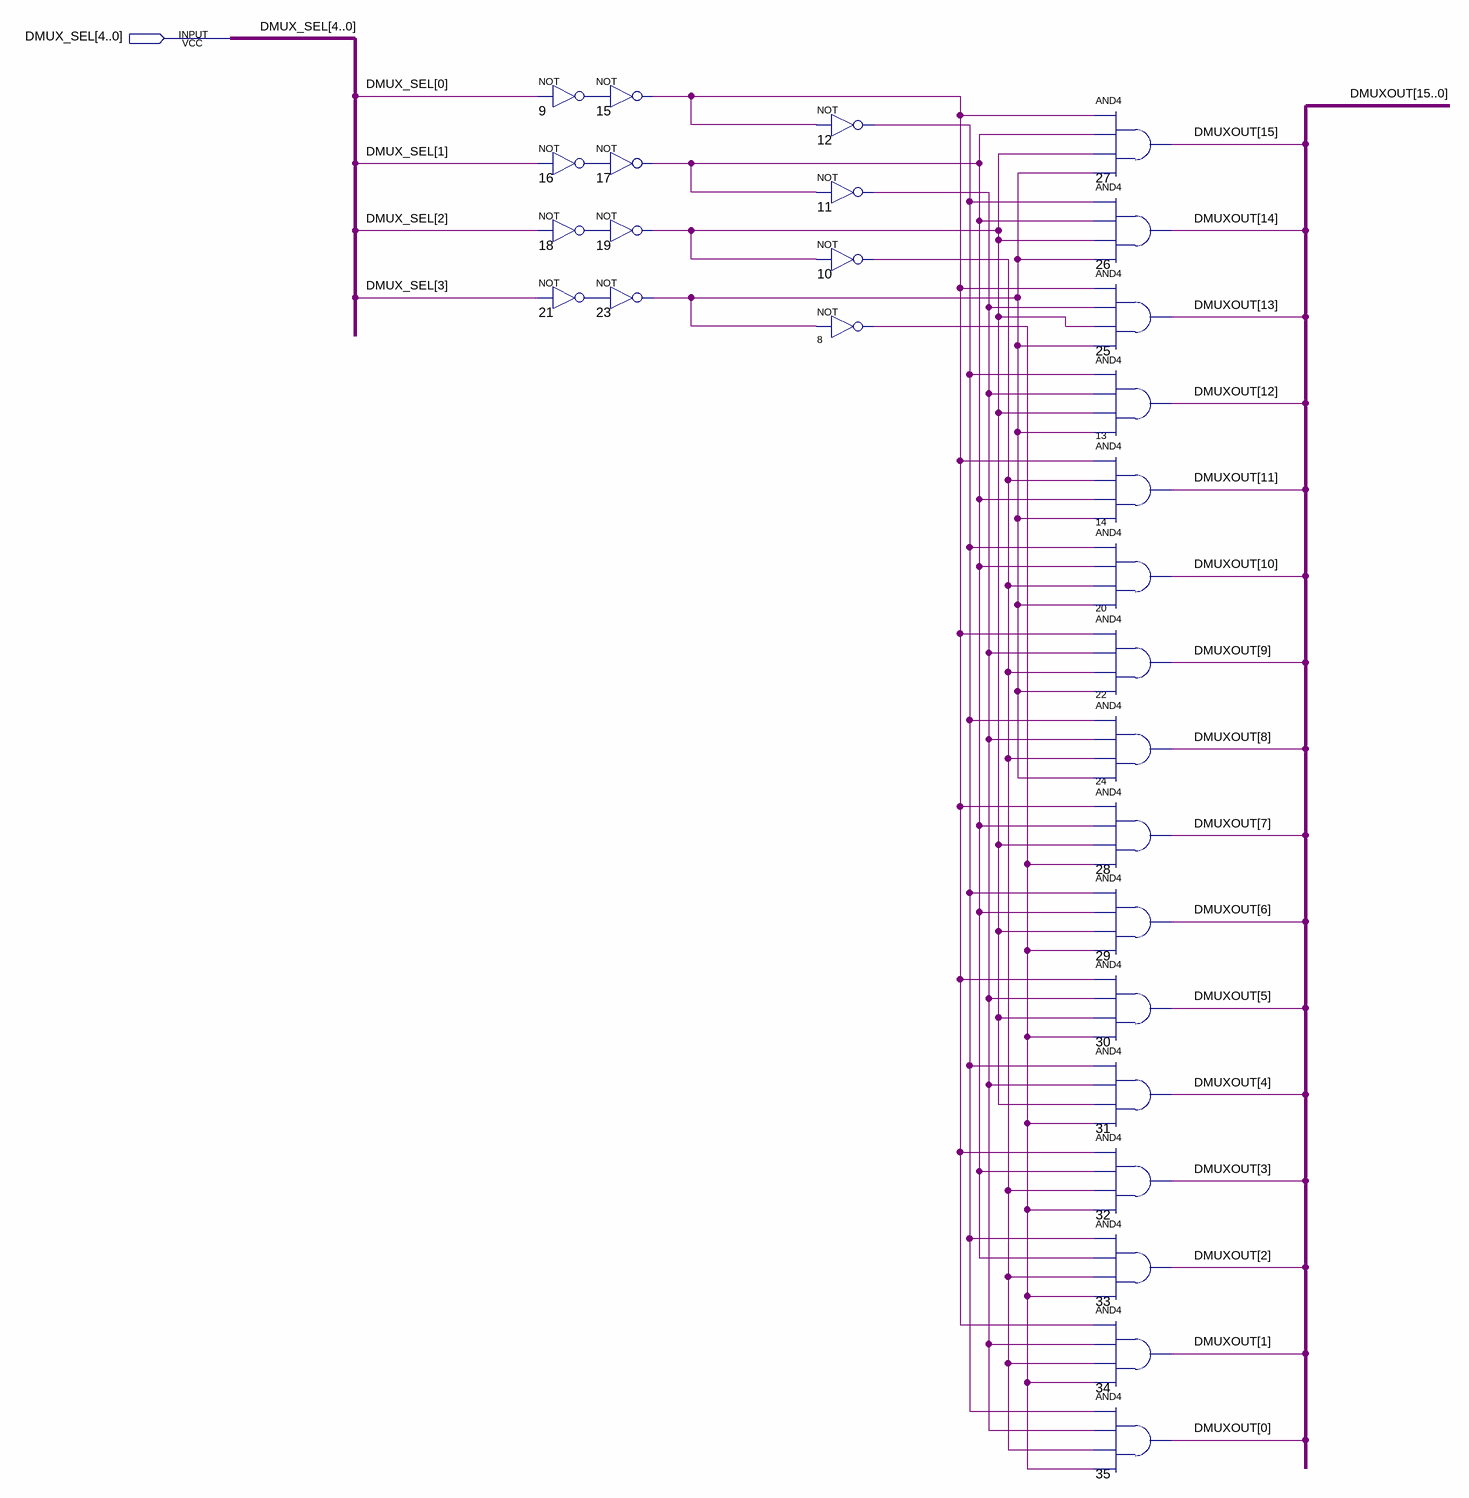
[diagram p0: schematic sheet]
// Quartus schematic C16dmuxer.bdf as structural Verilog: 28 symbols, 1 pins
module C16dmuxer (
  input  [4:0] DMUX_SEL
);

  wire n8_out, n9_out, n10_out, n11_out, n12_out, n15_out, n16_out, n17_out, n18_out, n19_out, n21_out,
       n23_out;
  wire [15:0] DMUXOUT;

  not u_9 (n9_out, DMUX_SEL[0]);
  not u_16 (n16_out, DMUX_SEL[1]);
  not u_18 (n18_out, DMUX_SEL[2]);
  not u_21 (n21_out, DMUX_SEL[3]);
  not u_15 (n15_out, n9_out);
  not u_17 (n17_out, n16_out);
  not u_19 (n19_out, n18_out);
  not u_23 (n23_out, n21_out);
  not u_12 (n12_out, n15_out);
  not u_11 (n11_out, n17_out);
  not u_10 (n10_out, n19_out);
  not u_8 (n8_out, n23_out);
  and u_27 (DMUXOUT[15], n15_out, n17_out, n19_out, n23_out);
  and u_26 (DMUXOUT[14], n12_out, n17_out, n19_out, n23_out);
  and u_25 (DMUXOUT[13], n15_out, n11_out, n19_out, n23_out);
  and u_13 (DMUXOUT[12], n12_out, n11_out, n19_out, n23_out);
  and u_14 (DMUXOUT[11], n15_out, n10_out, n17_out, n23_out);
  and u_20 (DMUXOUT[10], n12_out, n17_out, n10_out, n23_out);
  and u_22 (DMUXOUT[9], n15_out, n11_out, n10_out, n23_out);
  and u_24 (DMUXOUT[8], n12_out, n11_out, n10_out, n23_out);
  and u_28 (DMUXOUT[7], n15_out, n17_out, n19_out, n8_out);
  and u_29 (DMUXOUT[6], n12_out, n17_out, n19_out, n8_out);
  and u_30 (DMUXOUT[5], n15_out, n11_out, n19_out, n8_out);
  and u_31 (DMUXOUT[4], n12_out, n11_out, n19_out, n8_out);
  and u_32 (DMUXOUT[3], n15_out, n17_out, n10_out, n8_out);
  and u_33 (DMUXOUT[2], n12_out, n17_out, n10_out, n8_out);
  and u_34 (DMUXOUT[1], n15_out, n11_out, n10_out, n8_out);
  and u_35 (DMUXOUT[0], n12_out, n11_out, n10_out, n8_out);
endmodule
